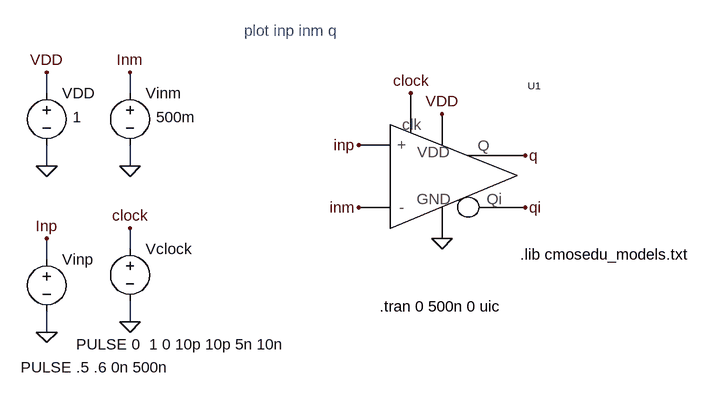
[diagram p0: schematic Fig17_17.asc]
Fig17_17.asc, the LTspice schematic file:
Version 4
SHEET 1 1556 680
WIRE 80 -400 80 -432
WIRE 80 -288 80 -320
WIRE 80 -144 80 -176
WIRE 80 -32 80 -64
WIRE 208 -400 208 -432
WIRE 208 -288 208 -320
WIRE 208 -160 208 -192
WIRE 208 -48 208 -80
FLAG 80 -288 0
FLAG 80 -432 VDD
FLAG 208 -288 0
FLAG 208 -432 Inm
FLAG 80 -32 0
FLAG 80 -176 Inp
FLAG 208 -48 0
FLAG 208 -192 clock
FLAG 560 -320 inp
FLAG 560 -224 inm
FLAG 688 -368 VDD
FLAG 640 -400 clock
FLAG 688 -176 0
FLAG 816 -304 q
FLAG 816 -224 qi
SYMBOL voltage 80 -416 R0
WINDOW 123 0 0 Left 0
WINDOW 39 0 0 Left 0
WINDOW 3 40 53 Left 0
SYMATTR Value 1
SYMATTR InstName VDD
SYMBOL voltage 208 -416 R0
WINDOW 123 0 0 Left 0
WINDOW 39 0 0 Left 0
WINDOW 3 40 53 Left 0
SYMATTR Value 500m
SYMATTR InstName Vinm
SYMBOL voltage 80 -160 R0
WINDOW 123 0 0 Left 0
WINDOW 39 0 0 Left 0
WINDOW 3 -40 182 Left 0
SYMATTR Value PULSE .5 .6 0n 500n
SYMATTR InstName Vinp
SYMBOL voltage 208 -176 R0
WINDOW 123 0 0 Left 0
WINDOW 39 0 0 Left 0
WINDOW 3 -83 163 Left 0
SYMATTR Value PULSE 0  1 0 10p 10p 5n 10n
SYMATTR InstName Vclock
SYMBOL Fig_17_16 608 -272 R0
SYMATTR InstName U1
TEXT 808 -152 Left 0 !.lib cmosedu_models.txt
TEXT 592 -72 Left 0 !.tran 0 500n 0 uic
TEXT 384 -496 Left 0 ;plot inp inm q

The netlist it stands for:
* Fig17_17.asc
VDD VDD 0 1
Vinm Inm 0 500m
Vinp Inp 0 PULSE .5 .6 0n 500n
Vclock clock 0 PULSE 0  1 0 10p 10p 5n 10n
XU1 Inp Inm q qi clock VDD 0 Fig_17_16  ; pins inp inm q qi clock VDD GND
.lib cmosedu_models.txt
.tran 0 500n 0 uic
* plot inp inm q
.backanno
.end